# EasyEDA schematic SCH_Oscilator2.0_2026-05-03.json
TITLE: Sheet_1; REV: 1.0; Date: 2025-05-31; Sheet: 1/1; Drawn By: rahber; Company: Your Company
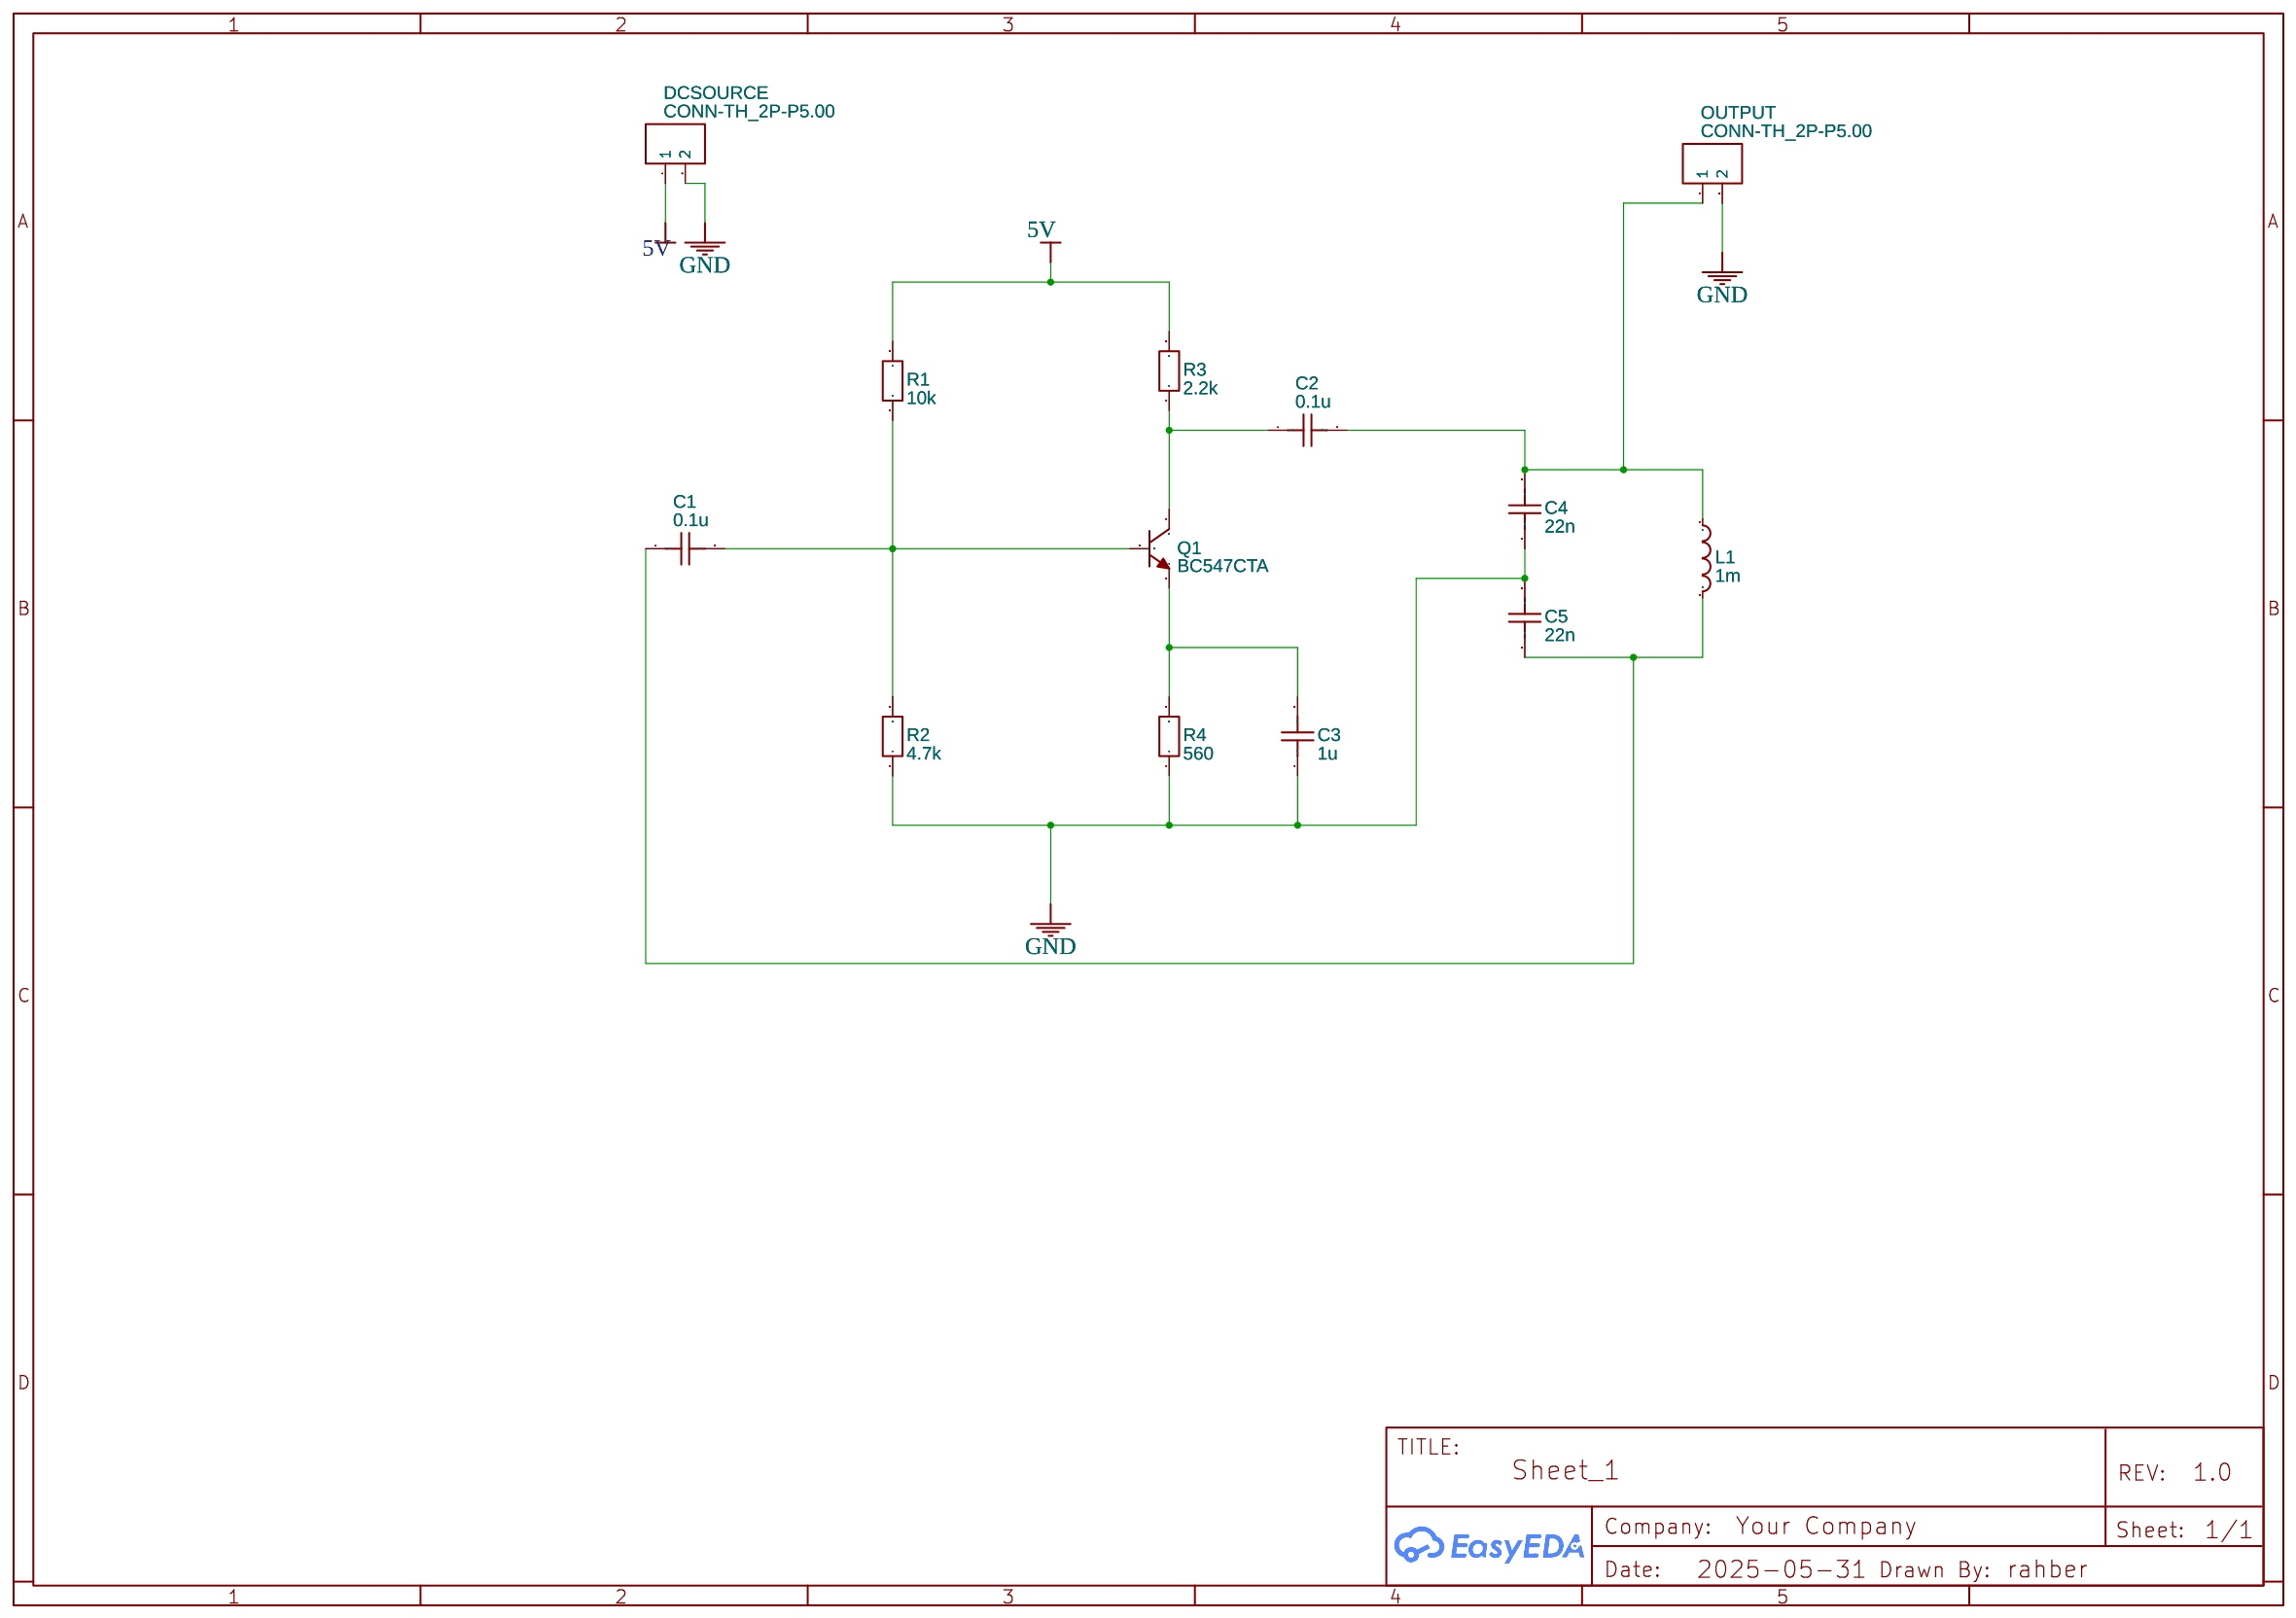
[diagram p0: schematic sheet]

## Parts
C1  0.1u  [RAD-0.1]
C2  0.1u  [RAD-0.1]
C3  1u  [RAD-0.1]
C4  22n  [RAD-0.1]
C5  22n  [RAD-0.1]
DCSOURCE  CONN-TH_2P-P5.00  [CONN-TH_2P-P5.00]
L1  1m  [L_AXIAL-0.4]
OUTPUT  CONN-TH_2P-P5.00  [CONN-TH_2P-P5.00]
Q1  BC547CTA  [TO-92-3_L4.8-W3.7-P2.54-L]
R1  10k  [R_AXIAL-0.5]
R2  4.7k  [R_AXIAL-0.5]
R3  2.2k  [R_AXIAL-0.5]
R4  560  [R_AXIAL-0.5]

## Library data of the parts
C1-C5 = C_RAD-0.1_US: Contributor: LCEDA_Lib
DCSOURCE OUTPUT = CONN-TH_2P-P5.00: Supplier: LCSC; Contributor: LCEDA_Lib
L1 = L_AXIAL-0.4_US: Contributor: LCEDA_Lib
Q1 = BC547CTA: Contributor: LCSC; Supplier: LCSC; Supplier Part: C900799; Manufacturer: onsemi(安森美); JLCPCB Part Class: Extended Part
R1-R4 = R_AXIAL-0.5_EU: Contributor: LCEDA_Lib

## Nets
5V: DCSOURCE.1 R1.2 R3.2
GND: C3.1 C4.1 C5.2 DCSOURCE.2 OUTPUT.2 R2.1 R4.1
Net-(C1-1): C1.1 C5.1 L1.2
Net-(C1-2): C1.2 Q1.2(B) R1.1 R2.2
Net-(C2-1): C2.1 Q1.1(C) R3.1
Net-(C2-2): C2.2 C4.2 L1.1 OUTPUT.1
Net-(C3-2): C3.2 Q1.3(E) R4.2
